# Altium schematic sheet EXE_IO.SchDoc
size 594 x 419 mm
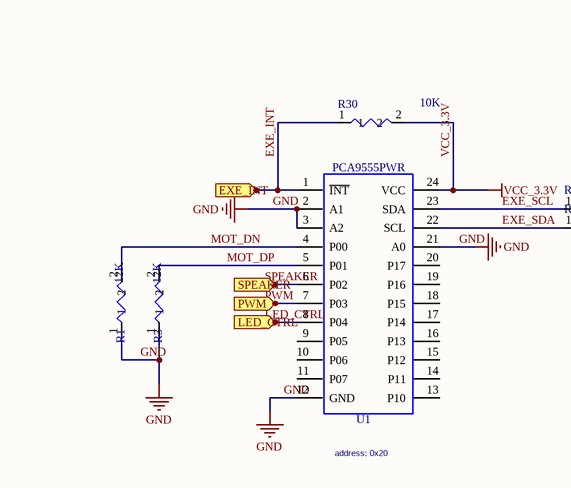
[diagram p0: EXE_IO.SchDoc, top left]
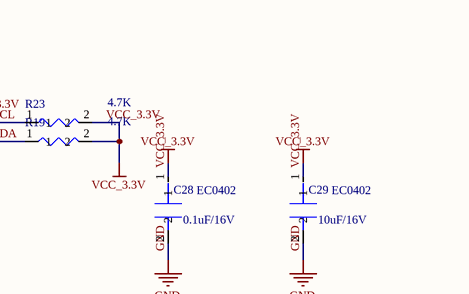
[diagram p1: EXE_IO.SchDoc, top right]
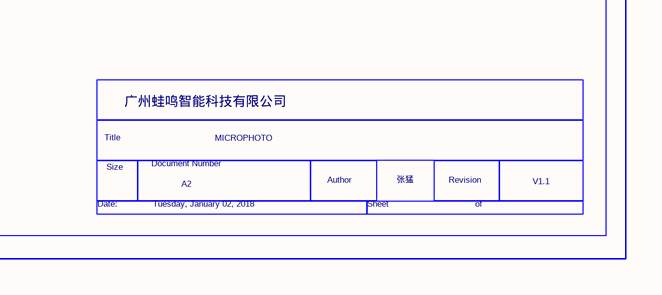
[diagram p2: EXE_IO.SchDoc, bottom right]

## Parts
C28  EC0402  value 0.1uF/16V
C29  EC0402  value 10uF/16V
R1  value 12K  (hidden comment: ER0402)
R3  value 12K  (hidden comment: ER0402)
R19  value 4.7K  (hidden comment: ER0402)
R23  value 4.7K  (hidden comment: ER0402)
R30  value 10K  (hidden comment: ER0402)
U1  PCA9555PWR

## Ports
EXE_INT, LED_CTRL, PWM, SPEAKER

## Nets
GND: C28.2 C29.2 R1.1 R3.1 U1.2(A1) U1.3(A2) U1.12(GND) U1.21(A0)
VCC_3.3V: C28.1 C29.1 R19.2 R23.2 R30.2 U1.24(VCC)
EXE_INT: R30.1 U1.1(~{INT}) ; port EXE_INT
EXE_SCL: R23.1 U1.23(SDA)
EXE_SDA: R19.1 U1.22(SCL)
LED_CTRL: U1.8(P04) ; port LED_CTRL
MOT_DN: R1.2 U1.4(P00)
MOT_DP: R3.2 U1.5(P01)
PWM: U1.7(P03) ; port PWM
SPEAKER: U1.6(P02) ; port SPEAKER

Not connected (* = marked no-connect by the designer): U1 9(P05) 10(P06) 11(P07) 13(P10) 14(P11) 15(P12) 16(P13) 17(P14) 18(P15) 19(P16) 20(P17)

## Notes on the sheet
- (near U1) address: 0x20
- 广州蛙鸣智能科技有限公司
- Title
- Size
- Document Number
- MICROPHOTO
- Date:
- Tuesday, January 02, 2018
- A2
- Author
- Sheet
- 张猛
- Revision
- of
- V1.1

## Library data of the parts
C28 C29 = EC0402: Source_Path: E:\PROJECT\BGA441\MAINCHIP_DDR2_DDR3_V1.0.DSN; PAGE: 2; PCB DECAL: EC0603
R19 R23 R30 = ER0402: PCB DECAL: EC0603
U1 = PCA9555PWR: PCB DECAL: CFP63P600X127-25N
R1 R3 = ER0402: PCB DECAL: ER0402